# Altium schematic sheet PCIe_USB30_Conn_Panel_Top.SchDoc
size A; SheetNumber: 11; SheetTotal: 12
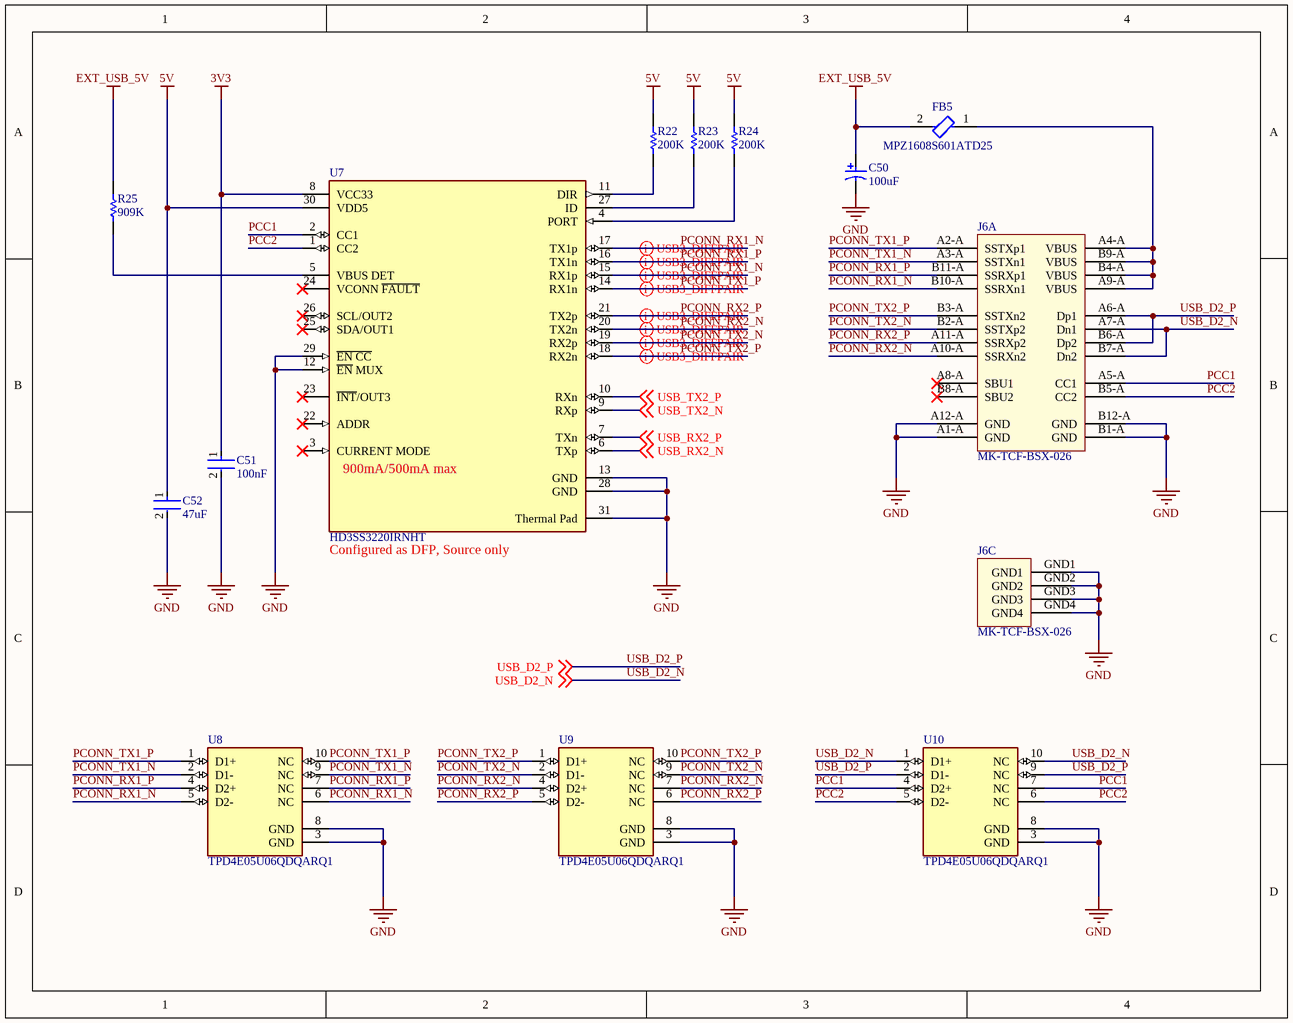
[diagram p0: PCIe_USB30_Conn_Panel_Top.SchDoc]

## Parts
C50  100uF  [PNSC-EEEFK1C101P_L]
C51  100nF  [FP-C0402-BB-MFG]
C52  47uF  [FP-C2012-125-0_2-IPC_B]
FB5  MPZ1608S601ATD25  [FP-MPZ1608-0_8-IPC_B]
J6  MK-TCF-BSX-026  [MK-TCF-BSX-026]  (parts A,C of 3)
R22  200K  [RESC1005X40X25NL05T05]
R23  200K  [RESC1005X40X25NL05T05]
R24  200K  [RESC1005X40X25NL05T05]
R25  909K  [RESC1005X40X25NL05T10]
U7  HD3SS3220IRNHT  [FP-RNH0030A-MFG]
U8  TPD4E05U06QDQARQ1  [FP-DQA0010A-MFG]
U9  TPD4E05U06QDQARQ1  [FP-DQA0010A-MFG]
U10  TPD4E05U06QDQARQ1  [FP-DQA0010A-MFG]

## Nets
3V3: C51.1 U7.8(VCC33)
5V: C52.1 R22.2 R23.2 R24.2 U7.30(VDD5)
EXT_USB_5V: C50.1 FB5.2 R25.2
GND: C50.2 C51.2 C52.2 J6.A1-A(GND) J6.A12-A(GND) J6.B1-A(GND) J6.B12-A(GND) J6.GND1 J6.GND2 J6.GND3 J6.GND4 U7.12(~{EN}_MUX) U7.13(GND) U7.28(GND) U7.29(~{EN_CC}) U7.31(Thermal_Pad) U8.3(GND) U8.8(GND) U9.3(GND) U9.8(GND) U10.3(GND) U10.8(GND)
PCC1: J6.A5-A(CC1) U7.2(CC1) U10.4(D2+) U10.7(NC)
PCC2: J6.B5-A(CC2) U7.1(CC2) U10.5(D2-) U10.6(NC)
PCONN_RX1_N: J6.B10-A(SSRXn1) U7.17(TX1p) U8.5(D2-) U8.6(NC)
PCONN_RX1_P: J6.B11-A(SSRXp1) U7.16(TX1n) U8.4(D2+) U8.7(NC)
PCONN_RX2_N: J6.A10-A(SSRXn2) U7.20(TX2n) U9.4(D2+) U9.7(NC)
PCONN_RX2_P: J6.A11-A(SSRXp2) U7.21(TX2p) U9.5(D2-) U9.6(NC)
PCONN_TX1_N: J6.A3-A(SSTXn1) U7.15(RX1p) U8.2(D1-) U8.9(NC)
PCONN_TX1_P: J6.A2-A(SSTXp1) U7.14(RX1n) U8.1(D1+) U8.10(NC)
PCONN_TX2_N: J6.B2-A(SSTXp2) U7.19(RX2p) U9.2(D1-) U9.9(NC)
PCONN_TX2_P: J6.B3-A(SSTXn2) U7.18(RX2n) U9.1(D1+) U9.10(NC)
USB_D2_N: J6.A7-A(Dn1) J6.B7-A(Dn2) U10.1(D1+) U10.10(NC) ; off-sheet USB_D2_N
USB_D2_P: J6.A6-A(Dp1) J6.B6-A(Dp2) U10.2(D1-) U10.9(NC) ; off-sheet USB_D2_P
USB_RX2_N: U7.6(TXp) ; off-sheet USB_RX2_N
USB_RX2_P: U7.7(TXn) ; off-sheet USB_RX2_P
USB_TX2_N: U7.9(RXp) ; off-sheet USB_TX2_N
USB_TX2_P: U7.10(RXn) ; off-sheet USB_TX2_P
NetFB5_1: FB5.1 J6.A4-A(VBUS) J6.A9-A(VBUS) J6.B4-A(VBUS) J6.B9-A(VBUS)
NetR22_1: R22.1 U7.11(DIR)
NetR23_1: R23.1 U7.27(ID)
NetR24_1: R24.1 U7.4(PORT)
NetR25_1: R25.1 U7.5(VBUS_DET)

Not connected (* = marked no-connect by the designer): J6 A8-A(SBU1)* B8-A(SBU2)*; U7 3(CURRENT_MODE)* 22(ADDR)* 23(~{INT}/OUT3)* 24(VCONN_~{FAULT})* 25(SDA/OUT1)* 26(SCL/OUT2)*

## Layout directives
differential pair; differential pair class USB3: PCONN_RX1_N, PCONN_RX1_P, PCONN_RX2_N, PCONN_RX2_P, PCONN_TX1_N, PCONN_TX1_P, PCONN_TX2_N, PCONN_TX2_P

## Notes on the sheet
- (near U7) 900mA/500mA max
- (near U7) Configured as DFP, Source only

## Library data of the parts
C50 = CMP-2000-06203-1: Aluminum Electrolytic Capacitor, 100 uF, 20%, 16 V, -55 to 105 degC, 2-Pin SMD, RoHS, Tape and Reel; Manufacturer: Panasonic; Lifetime@Temperature: 2000Hrs@105°C; Impedance: 0.36O; Ripple Current: 240mA; Rated Voltage: 16V; Type: Can; Capacitance: 100µF; Datasheet URL: http://datasheet.octopart.com/EEEFK1C101P-Panasonic-datasheet-13266987.pdf; Package Description: 2-Pin Surface Mount Device, Body 6.6 x 6.6 mm; Manufacturer URL: http://www.panasonic.com/; Case Size/Dimension: Ø6.3x5.8mm; Series: FK; Datasheet Version: 11/2012; Mounting Technology: SurfaceMount; Package Reference: EEEFK1C101P; Operating Temp-Max: 105°C; Operating Temp Range: -55to+105°C
C51 = CMP-2008-02046-2: CAP CER 0.1UF 10V X5R 0402; Manufacturer: Kemet; Manufacturer Part Number: C0402C104K8PACTU; Material: Ceramic; Capacitance: 0.10 μF; Temperature Coefficient: 15%; Tolerance: 0.1; Value: 0.10 μF; Package: C0402-BB; Temperature: -55°C to +125°C; ComponentLink2Description: Datasheet; Temperature Characteristic: X5R; Device Class L1: Passive Components; Height: 0.55mm; Lead Free: Yes; ComponentLink2URL: https://content.kemet.com/datasheets/KEM_C1002_X7R_SMD.pdf; Device Class L2: Capacitors; Temperature Range Low: -55°C; Temperature Range High: +125°C; RoHS: TRUE; Octopart: https://octopart.com/c0402c104k8pactu-kemet-140039; Automotive: No; Mouser Description: Capacitor 100 nF 10 VDC 0402; Category: Cap; Voltage Rating: 10 V; Digikey Description: CAP CER 0.1UF 10V X5R 0402; Ipc Land Pattern Name: CAPC10050X50; Device Class L3: Ceramic Capacitors
C52 = CMP-2000-05451-2: Multilayer Ceramic Capacitors 47μF ±20% 10V X5R SMD 0805; RoHS Compliant: Yes; Dielectric: X5R; Case Code (Imperial): 0805; Min Operating Temperature: -55°C; Capacitance: 47uF; Length: 2mm; Voltage Rating: 10V; Lead Free: Lead Free; Weight: 0.000194oz; Resistor Type: Ceramic; Dielectric Material: Ceramic; Max Operating Temperature: 85°C; Height: 1.25mm; Width: 0.049inch; Depth: 1.25mm; Termination: SMD/SMT; Case/Package: 0805; Voltage Rating (DC): 10V; Voltage: 10V; Thickness: 0.057inch; Tolerance: 20%; REACH SVHC: No SVHC; Package Quantity: 1; Series: C; Case Code (Metric): 2012; Mount: Surface Mount; Packaging: Tape and Reel
FB5 = CMP-08257-000403-1: Power line Ferrite Bead 600Ω @ 100MHz 1A DCR 0.15Ω AEC-Q200 SMD 0603; Number of Lines: 1; DC Resistance (DCR): 150mR; Impedance: 600R; Tolerance: 25%; Length: 0.063inch; Max Operating Temperature: 125°C; Lead Free: Lead Free; Min Operating Temperature: -55°C; Test Frequency: 100MHz; Termination: SMD/SMT; Packaging: Tape and Reel; Package Quantity: 4000; Case Code (Metric): 1608; Series: MPZ; Max Current Rating: 1A; Mount: Surface Mount; Max DC Current: 1A; RoHS Compliant: Yes; Case/Package: 0603; Weight: 7.1E-05oz; Ratings: AEC-Q200; Height: 0.037inch; Width: 0.031inch; Case Code (Imperial): 0603
R22-R24 = CMP-1011-00768-4: Chip Resistor, 200 KOhm, +/- 1%, 100 mW, -55 to 155 degC, 0402 (1005 Metric), RoHS, Tape and Reel; PartNumber: ERJ-2RKF2003X; Manufacturer: Basic Passives; Case\/Package: 0402; Voltage Rating: 50 V; Power Rating: 100 mW; RoHSCompliant: true; Length: 1 mm; DatasheetVersion: 04/2015; ComponentLink2URL: http://industrial.panasonic.com/cdbs/www-data/pdf/RDA0000/AOA0000C86.pdf; Mount: Surface Mount; PackageDescription: 2-Pin Surface Mount Device, Body 1 x 0.5 mm; Tolerance: 1%; Width: 0.5 mm; ComponentLink2Description: Datasheet; Packaging: Tape and Reel; REACH SVHC: No SVHC; Min Operating Temperature: -55 degC; Package Quantity: 10000; ComponentLink1Description: Manufacturer URL; Height: 0.35 mm; ComponentLink1URL: http://www.panasonic.com/; Mounting Technology: Surface Mount; Case Code (Imperial): 0402; PackageReference: 0402; Radiation Hardening: No; Pins: 2; Max Operating Temperature: 155 degC; Resistance: 200 KOhm; Case Code (Metric): 1005
R25 = CMP-1011-00844-2: Manufacturer: Yageo / Phycomp; Part Number: RC0402FR-07909KL
U7 = CMP-04877-000019-1: USB TYPE-C DRP PORT CONTROLLER W; Max Supply Voltage: 5.5V; Min Supply Voltage: 3V; Number of Ports: 1; Data Rate: 10Gbps; USB Standard: USB 3.1; Mount: Surface Mount; Max Operating Temperature: 70°C; Lead Free: Lead Free; RoHS Compliant: Yes; Packaging: Tape and Reel; Number of Pins: 30; Min Operating Temperature: 0°C; REACH SVHC: No SVHC
U8-U10 = CMP-04985-000004-1: TVS DIODE 5.5V 14V 10USON; Manufacturer: Texas Instruments; Direction: Unidirectional; Standoff Height: 0mm; Capacitance: 0.5pF; Number Of Channels: 4; Breakdown Voltage: 6.4V; Peak Pulse Power: 2.5W; Automotive Grade: Grade 1; Value: 0.5pF; Interface: USB,Ethernet,LVDS,Other; Peak Pulse Current: 2.5A; Operating Supply Voltage: 5.5V; Reverse Standoff Voltage: 5.5V; Package: DQA0010A; Temperature Range Low: -40°C; Temperature Range High: +125°C; Ambient Temperature Range Low: -40°C; Device Class L1: Circuit Protection; Clamping Voltage: 14V; Manufacturer Part Number: TPD4E05U06QDQARQ1; Device Class L2: ESD and Circuit Protection ICs; Octopart: https://octopart.com/tpd4e05u06qdqarq1-texas+instruments-48523459; Device Class L3: unset; Height: 0.55mm; Automotive: Yes; ComponentLink2Description: Datasheet; RoHS: TRUE; Ambient Temperature Range High: +125°C; Category: IC; Mouser Description: Automotive 4-Channel ESD Protection Solution for SuperSpeed (up to 5 Gbps) Interface 10-USON -40 to 125; Temperature: -40°C to +125°C; ComponentLink2URL: http://www.ti.com/lit/ds/symlink/tpd4e05u06-q1.pdf; Digikey Description: TVS DIODE 5.5V 14V 10USON; Lead Free: Yes